# Altium schematic sheet Sheet1.SchDoc
size A; SheetNumber: 2; SheetTotal: 4
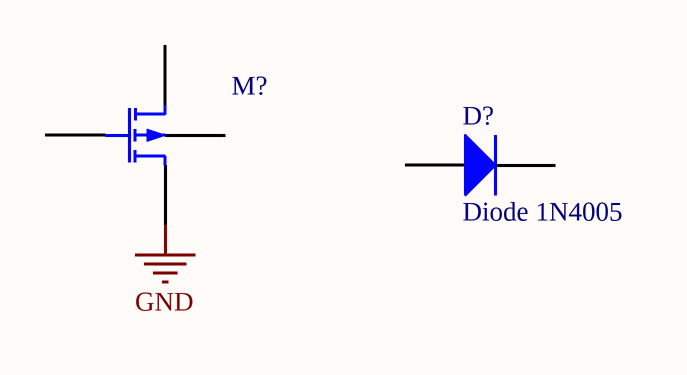
[diagram p0: Sheet1.SchDoc]

## Parts
D?  Diode 1N4005  [DO-41]
M?  P-channel MOSFET BSIM3v32 v3.2 - 3.2.4 Model  (value not drawn)

## Nets
GND: M?.3(S)

Not connected (* = marked no-connect by the designer): D? 1(A) 2(K); M? 1(D) 2(G) 4(B)

## Library data of the parts
D? = Diode 1N4005: 1 Amp General Purpose Rectifier; Published: 8-Jun-2000; LatestRevisionDate: 17-Jul-2002; LatestRevisionNote: Re-released for DXP Platform.; DatasheetVersion: 1998; PackageVersion: Aug-1999; PackageReference: DO-41; Publisher: Altium Limited; PackageDescription: Diode, Axial; Body 5.2 x 2.7 mm (LxDia. max), Lead Dia. 0.86 mm (max); Code_JEDEC: DO-204-AL; ComponentLink1Description: Manufacturer Link; ComponentLink1URL: http://www.fairchildsemi.com/; ComponentLink2Description: Datasheet; ComponentLink2URL: http://www.fairchildsemi.com/ds/1N%2F1N4001.pdf
M? = MOSFET P-ch Lev8_2: A0: 1; A1: 0; AT: 33000; BETA0: 30; CAPMOD: 3; CDSC: 0.00024; CF: 7.29897e-11; CGDO: 2.07188e-10; CJ: 0.0005; CJSW: 5e-10; CKAPPA: 0.6; CLC: 1e-07; DELTA: 0.01; DROUT: 0.56; DVT0: 2.2; DVT1: 0.53; DVT1W: 5.3e06; DVT2: -0.032; ELM: 5; EM: 4.1e07; ETA0: 0.08; ETAB: -0.07; IJTH: 0.1; JS: 0.0001; K3: 80; KETA: -0.047; KT1: -0.11; KT2: 0.022; LETAB: -0; MJ: 0.5; MJSW: 0.33; MOIN: 15; NCH: 1.7e17; NLX: 1.74e-07; NOIA: 1e20; NOIB: 50000; NOIC: -1.4e-12; NSUB: 6e16; PCLM: 1.3; PDIBLC1: 0.39; PDIBLC2: 0.0086; PSCBE1: 4.24e08; PSCBE2: 1e-05; TNOM: 300.15; TOX: 1.5e-08; U0: 0.067; UA: 2.25e-09; UA1: 4.31e-09; UB: 5.87e-19; UB1: -7.61e-18; UC: -4.65e-11; UC1: -5.6e-11; UTE: -1.5; VBD_MAX: 1e99; VBM: -3; VFBCV: -1; VOFF: -0.08; VSAT: 80000; VTH0: 0.7; W0: 2.5e-06; XJ: 1.5e-07; XT: 1.55e-07; SimulationGenericComponent: True; A2: 1; ACDE: 1; ACM: 0; AF: 1; AGS: 0; ALPHA0: 0; ALPHA1: 0; B0: 0; B1: 0; BINUNIT: 1; CALCACM: 0; CDSCB: 0; CDSCD: 0; CGBO: 0; CGDL: 0; CGSL: 0; CGSO: 2.07188e-10; CIT: 0; CJSWG: 5e-10; CLE: 0.6; DLC: 0; DSUB: 0.56; DVT0W: 0; DVT2W: -0.032; DWB: 0; DWC: 0; DWG: 0; EF: 1; GAMMA1: 0; GAMMA2: 0; HDIF: 0; JSW: 0; K1: 0; K2: 0; K3B: 0; KF: 0; KT1L: 0; LA0: 0; LA1: 0; LA2: 0; LACDE: 0; LAGS: 0; LALPHA0: 0; LALPHA1: 0; LAT: 0; LB0: 0; LB1: 0; LBETA0: 0; LCDSC: 0; LCDSCB: 0; LCDSCD: 0; LCF: 0; LCGDL: 0; LCGSL: 0; LCIT: 0; LCKAPPA: 0; LCLC: 0; LCLE: 0; LD: 0; LDELTA: 0; LDIF: 0; LDROUT: 0; LDSUB: 0; LDVT0: 0; LDVT0W: 0; LDVT1: 0; LDVT1W: 0; LDVT2: 0; LDVT2W: 0; LDWB: 0; LDWG: 0; LELM: 0; LETA0: 0; LGAMMA1: 0; LGAMMA2: 0; LINT: 0; LINTNOI: 0; LK1: 0; LK2: 0; LK3: 0; LK3B: 0; LKETA: 0; LKT1: 0; LKT1L: 0; LKT2: 0; LL: 0; LLC: 0; LLN: 1; LMAX: 1; LMIN: 0; LMOIN: 0; LNCH: 0; LNFACTOR: 0; LNGATE: 0; LNLX: 0; LNOFF: 0; LNSUB: 0; LPCLM: 0; LPDIBLC1: 0; LPDIBLC2: 0; LPDIBLCB: 0; LPRT: 0; LPRWB: 0; LPRWG: 0; LPSCBE1: 0; LPSCBE2: 0; LPVAG: 0; LRDSW: 0; LU0: 0; LUA: 0; LUA1: 0; LUB: 0; LUB1: 0; LUC: 0; LUC1: 0; LUTE: 0; LVBM: 0; LVBX: 0; LVFB: 0; LVFBCV: 0; LVOFF: 0; LVOFFCV: 0; LVSAT: 0; LVTH0: 0; LW: 0; LW0: 0; LWC: 0; LWL: 0; LWLC: 0; LWN: 1; LWR: 0; LXJ: 0; LXT: 0; MJSWG: 0.33; MOBMOD: 1; NFACTOR: 1; NGATE: 0; NJ: 1; NOFF: 1; NOIMOD: 1; PA0: 0; PA1: 0; PA2: 0; PACDE: 0; PAGS: 0; PALPHA0: 0; PALPHA1: 0; PARAMCHK: 0; PAT: 0; PB: 1; PB0: 0; PB1: 0; PBETA0: 0; PBSW: 1; PBSWG: 1; PCDSC: 0; PCDSCB: 0; PCDSCD: 0; PCF: 0; PCGDL: 0; PCGSL: 0; PCIT: 0; PCKAPPA: 0; PCLC: 0; PCLE: 0; PDELTA: 0; PDIBLCB: 0; PDROUT: 0; PDSUB: 0; PDVT0: 0; PDVT0W: 0; PDVT1: 0; PDVT1W: 0; PDVT2: 0; PDVT2W: 0; PDWB: 0; PDWG: 0; PELM: 0; PETA0: 0; PETAB: 0; PGAMMA1: 0; PGAMMA2: 0; PK1: 0; PK2: 0; PK3: 0; PK3B: 0; PKETA: 0; PKT1: 0; PKT1L: 0; PKT2: 0; PMOIN: 0; PNCH: 0; PNFACTOR: 0; PNGATE: 0; PNLX: 0; PNOFF: 0; PNSUB: 0; PPCLM: 0; PPDIBLC1: 0; PPDIBLC2: 0; PPDIBLCB: 0; PPRT: 0; PPRWB: 0; PPRWG: 0; PPSCBE1: 0; PPSCBE2: 0; PPVAG: 0; PRDSW: 0; PRT: 0; PRWB: 0; PRWG: 0; PU0: 0; PUA: 0; PUA1: 0; PUB: 0; PUB1: 0; PUC: 0; PUC1: 0; PUTE: 0; PVAG: 0; PVBM: 0; PVBX: 0; PVFB: 0; PVFBCV: 0; PVOFF: 0; PVOFFCV: 0; PVSAT: 0; PVTH0: 0; PW0: 0; PWR: 0; PXJ: 0; PXT: 0; RD: 0; RDC: 0; RDSW: 0; RS: 0; RSC: 0; RSH: 0; TCJ: 0; TCJSW: 0; TCJSWG: 0; TOXM: 1.5e-08; TPB: 0; TPBSW: 0; TPBSWG: 0; VBDR_MAX: 1e99; VBS_MAX: 1e99; VBSR_MAX: 1e99; VBX: 0; VDS_MAX: 1e99; VERSION: 3.3.0; VFB: 0; VGB_MAX: 1e99; VGBR_MAX: 1e99; VGD_MAX: 1e99; VGDR_MAX: 1e99; VGS_MAX: 1e99; VGSR_MAX: 1e99; VOFFCV: 0; WA0: 0; WA1: 0; WA2: 0; WACDE: 0; WAGS: 0; WALPHA0: 0; WALPHA1: 0; WAT: 0; WB0: 0; WB1: 0; WBETA0: 0; WCDSC: 0; WCDSCB: 0; WCDSCD: 0; WCF: 0; WCGDL: 0; WCGSL: 0; WCIT: 0; WCKAPPA: 0; WCLC: 0; WCLE: 0; WDELTA: 0; WDROUT: 0; WDSUB: 0; WDVT0: 0; WDVT0W: 0; WDVT1: 0; WDVT1W: 0; WDVT2: 0; WDVT2W: 0; WDWB: 0; WDWG: 0; WELM: 0; WETA0: 0; WETAB: 0; WGAMMA1: 0; WGAMMA2: 0; WINT: 0; WK1: 0; WK2: 0; WK3: 0; WK3B: 0; WKETA: 0; WKT1: 0; WKT1L: 0; WKT2: 0; WL: 0; WLC: 0; WLN: 1; WMAX: 1; WMIN: 0; WMLT: 1; WMOIN: 0; WNCH: 0; WNFACTOR: 0; WNGATE: 0; WNLX: 0; WNOFF: 0; WNSUB: 0; WPCLM: 0; WPDIBLC1: 0; WPDIBLC2: 0; WPDIBLCB: 0; WPRT: 0; WPRWB: 0; WPRWG: 0; WPSCBE1: 0; WPSCBE2: 0; WPVAG: 0; WR: 1; WRDSW: 0; WU0: 0; WUA: 0; WUA1: 0; WUB: 0; WUB1: 0; WUC: 0; WUC1: 0; WUTE: 0; WVBM: 0; WVBX: 0; WVFB: 0; WVFBCV: 0; WVOFF: 0; WVOFFCV: 0; WVSAT: 0; WVTH0: 0; WW: 0; WW0: 0; WWC: 0; WWL: 0; WWLC: 0; WWN: 1; WWR: 0; WXJ: 0; WXT: 0; XL: 0; XPART: 0; XTI: 3; XW: 0